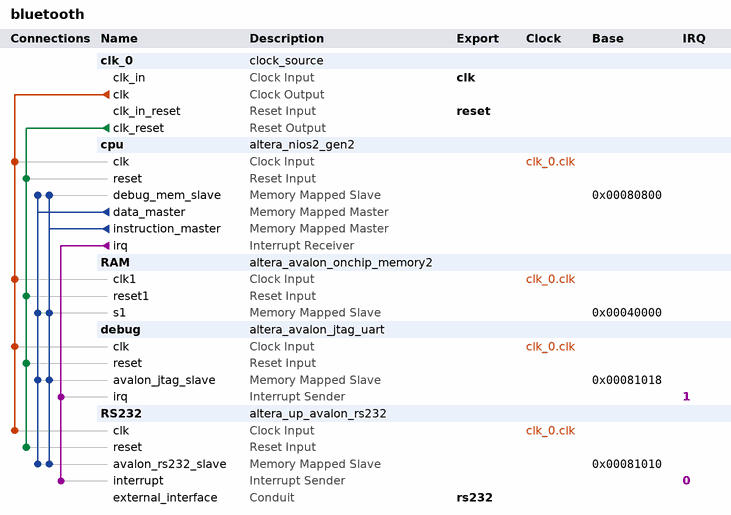
[diagram p0: system contents]
# Platform Designer (Qsys) system bluetooth, Cyclone IV E EP4CE115F29C7
# Parameters at their usual value, and those the tool derives, are not listed.
package require -exact qsys 17.1
create_system bluetooth
set_project_property DEVICE_FAMILY {Cyclone IV E}
set_project_property DEVICE EP4CE115F29C7

add_instance clk_0 clock_source 17.1
set_instance_parameter_value clk_0 clockFrequency 50000000

add_instance cpu altera_nios2_gen2 17.1
set_instance_parameter_value cpu dcache_size 2048
set_instance_parameter_value cpu exceptionSlave RAM.s1
set_instance_parameter_value cpu icache_size 4096
set_instance_parameter_value cpu impl Tiny
set_instance_parameter_value cpu resetSlave RAM.s1

add_instance RAM altera_avalon_onchip_memory2 17.1
set_instance_parameter_value RAM dataWidth 32
set_instance_parameter_value RAM dualPort false
set_instance_parameter_value RAM initMemContent true
set_instance_parameter_value RAM initializationFileName onchip_mem.hex
set_instance_parameter_value RAM memorySize 204800

add_instance debug altera_avalon_jtag_uart 17.1
set_instance_parameter_value debug simInteractiveOptions NO_INTERACTIVE_WINDOWS

add_instance RS232 altera_up_avalon_rs232 17.1
set_instance_parameter_value RS232 baud 9600
set_instance_parameter_value RS232 parity None

# connections
add_connection clk_0.clk cpu.clk clock
add_connection clk_0.clk debug.clk clock
add_connection clk_0.clk RAM.clk1 clock
add_connection clk_0.clk RS232.clk clock
add_connection clk_0.clk_reset cpu.reset reset
add_connection clk_0.clk_reset debug.reset reset
add_connection clk_0.clk_reset RAM.reset1 reset
add_connection clk_0.clk_reset RS232.reset reset
add_connection cpu.data_master cpu.debug_mem_slave avalon
set_connection_parameter_value cpu.data_master/cpu.debug_mem_slave baseAddress 0x00080800
add_connection cpu.data_master debug.avalon_jtag_slave avalon
set_connection_parameter_value cpu.data_master/debug.avalon_jtag_slave baseAddress 0x00081018
add_connection cpu.data_master RAM.s1 avalon
set_connection_parameter_value cpu.data_master/RAM.s1 baseAddress 0x00040000
add_connection cpu.data_master RS232.avalon_rs232_slave avalon
set_connection_parameter_value cpu.data_master/RS232.avalon_rs232_slave baseAddress 0x00081010
add_connection cpu.instruction_master cpu.debug_mem_slave avalon
set_connection_parameter_value cpu.instruction_master/cpu.debug_mem_slave baseAddress 0x00080800
add_connection cpu.instruction_master debug.avalon_jtag_slave avalon
set_connection_parameter_value cpu.instruction_master/debug.avalon_jtag_slave baseAddress 0x00081018
add_connection cpu.instruction_master RAM.s1 avalon
set_connection_parameter_value cpu.instruction_master/RAM.s1 baseAddress 0x00040000
add_connection cpu.instruction_master RS232.avalon_rs232_slave avalon
set_connection_parameter_value cpu.instruction_master/RS232.avalon_rs232_slave baseAddress 0x00081010
add_connection cpu.irq debug.irq interrupt
set_connection_parameter_value cpu.irq/debug.irq irqNumber 1
add_connection cpu.irq RS232.interrupt interrupt
set_connection_parameter_value cpu.irq/RS232.interrupt irqNumber 0

# exported interfaces
add_interface clk clock sink
set_interface_property clk EXPORT_OF clk_0.clk_in
add_interface reset reset sink
set_interface_property reset EXPORT_OF clk_0.clk_in_reset
add_interface rs232 conduit end
set_interface_property rs232 EXPORT_OF RS232.external_interface

set_interconnect_requirement {$system} qsys_mm.clockCrossingAdapter HANDSHAKE
set_interconnect_requirement {$system} qsys_mm.enableEccProtection FALSE
set_interconnect_requirement {$system} qsys_mm.insertDefaultSlave FALSE
set_interconnect_requirement {$system} qsys_mm.maxAdditionalLatency 1

save_system bluetooth.qsys
